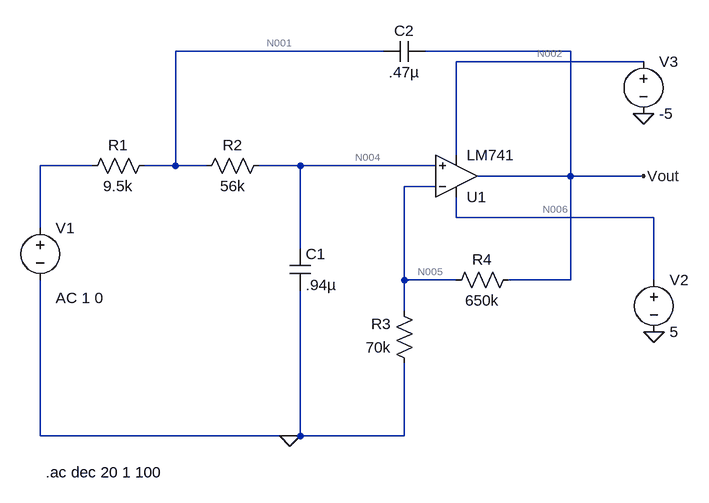
[diagram p0: schematic butterworth.asc]
butterworth.asc, the LTspice schematic file:
Version 4
SHEET 1 1364 680
WIRE 656 -160 336 -160
WIRE 944 -160 720 -160
WIRE 1056 -144 768 -144
WIRE 768 0 768 -144
WIRE 208 16 128 16
WIRE 336 16 336 -160
WIRE 336 16 288 16
WIRE 384 16 336 16
WIRE 528 16 464 16
WIRE 736 16 528 16
WIRE 944 32 944 -160
WIRE 944 32 800 32
WIRE 1056 32 944 32
WIRE 736 48 688 48
WIRE 768 96 768 64
WIRE 1072 96 768 96
WIRE 128 112 128 16
WIRE 528 144 528 16
WIRE 688 192 688 48
WIRE 768 192 688 192
WIRE 944 192 944 32
WIRE 944 192 848 192
WIRE 1072 192 1072 96
WIRE 688 240 688 192
WIRE 128 432 128 192
WIRE 512 432 128 432
WIRE 528 432 528 208
WIRE 528 432 512 432
WIRE 688 432 688 320
WIRE 688 432 528 432
FLAG 512 432 0
FLAG 1056 32 Vout
FLAG 1072 272 0
FLAG 1056 -64 0
SYMBOL voltage 128 96 R0
WINDOW 123 24 124 Left 2
WINDOW 39 0 0 Left 0
SYMATTR Value2 AC 1 0
SYMATTR InstName V1
SYMATTR Value ""
SYMBOL res 304 0 R90
WINDOW 0 0 56 VBottom 2
WINDOW 3 32 56 VTop 2
SYMATTR InstName R1
SYMATTR Value 9.5k
SYMBOL res 480 0 R90
WINDOW 0 0 56 VBottom 2
WINDOW 3 32 56 VTop 2
SYMATTR InstName R2
SYMATTR Value 56k
SYMBOL res 864 176 R90
WINDOW 0 0 56 VBottom 2
WINDOW 3 32 56 VTop 2
SYMATTR InstName R4
SYMATTR Value 650k
SYMBOL res 704 336 R180
WINDOW 0 36 76 Left 2
WINDOW 3 36 40 Left 2
SYMATTR InstName R3
SYMATTR Value 70k
SYMBOL cap 512 144 R0
SYMATTR InstName C1
SYMATTR Value .94µ
SYMBOL cap 720 -176 R90
WINDOW 0 0 32 VBottom 2
WINDOW 3 32 32 VTop 2
SYMATTR InstName C2
SYMATTR Value .47µ
SYMBOL LM741 768 96 M180
SYMATTR InstName U1
SYMBOL voltage 1072 176 R0
WINDOW 123 0 0 Left 0
WINDOW 39 0 0 Left 0
SYMATTR InstName V2
SYMATTR Value 5
SYMBOL voltage 1056 -160 R0
WINDOW 123 0 0 Left 0
WINDOW 39 0 0 Left 0
SYMATTR InstName V3
SYMATTR Value -5
TEXT 136 488 Left 2 !.ac dec 20 1 100

The netlist it stands for:
* butterworth.asc
V1 N003 0 AC 1 0
R1 N001 N003 9.5k
R2 N004 N001 56k
R4 Vout N005 650k
R3 0 N005 70k
C1 N004 0 .94µ
C2 Vout N001 .47µ
XU1 N004 N005 N006 N002 Vout LM741  ; pins In+ In- V+ V- OUT
V2 N006 0 5
V3 N002 0 -5
.ac dec 20 1 100
.lib LM741.lib
.backanno
.end

* Results of the author's LTspice run, read from the files saved beside the schematic
* Operating Point, zero values left out:
*   V(n001) = -549.8 µV
*   V(n004) = -3.79 mV
*   V(vout) = 37.51 mV
*   V(n005) = -2.791 mV
*   V(n002) = -5 V
*   V(n006) = 5 V
*   I(R3) = 39.87 nA
*   I(R4) = 62 nA
*   I(R2) = -57.87 nA
*   I(R1) = -57.87 nA
*   I(V3) = 1.451 mA
*   I(V2) = -1.451 mA
*   I(V1) = -57.87 nA
*   Ix(u1:1) = 57.87 nA
*   Ix(u1:2) = 101.9 nA
*   Ix(u1:99) = 1.451 mA
*   Ix(u1:50) = -1.451 mA
*   Ix(u1:28) = -62 nA
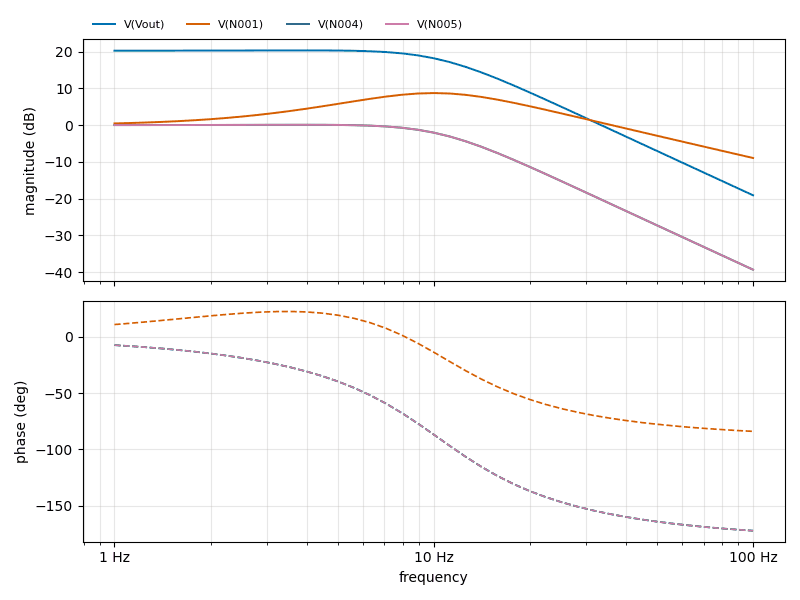
[diagram p1: AC Analysis of butterworth.asc, plotted from the saved traces]
* AC Analysis, 1 run:
*   V(Vout): 20.26 dB at 1 Hz, -19.10 dB at 100 Hz, peak 20.33 dB at 3.981 Hz, 3 dB below the peak at 11.01 Hz
*   V(N001): 0.46 dB at 1 Hz, -8.95 dB at 100 Hz, peak 8.72 dB at 10 Hz, 3 dB below the peak at 4.951 Hz and 18.59 Hz
*   V(N004): 0.01 dB at 1 Hz, -39.34 dB at 100 Hz, peak 0.09 dB at 3.981 Hz, 3 dB below the peak at 11.01 Hz
*   V(N005): 0.01 dB at 1 Hz, -39.34 dB at 100 Hz, peak 0.09 dB at 3.981 Hz, 3 dB below the peak at 11.01 Hz